# EAGLE design ASD2004 (EAGLE 6.3)
DATABASE: ./../../../../../Components/TinyCircuits_Part_Database.txt
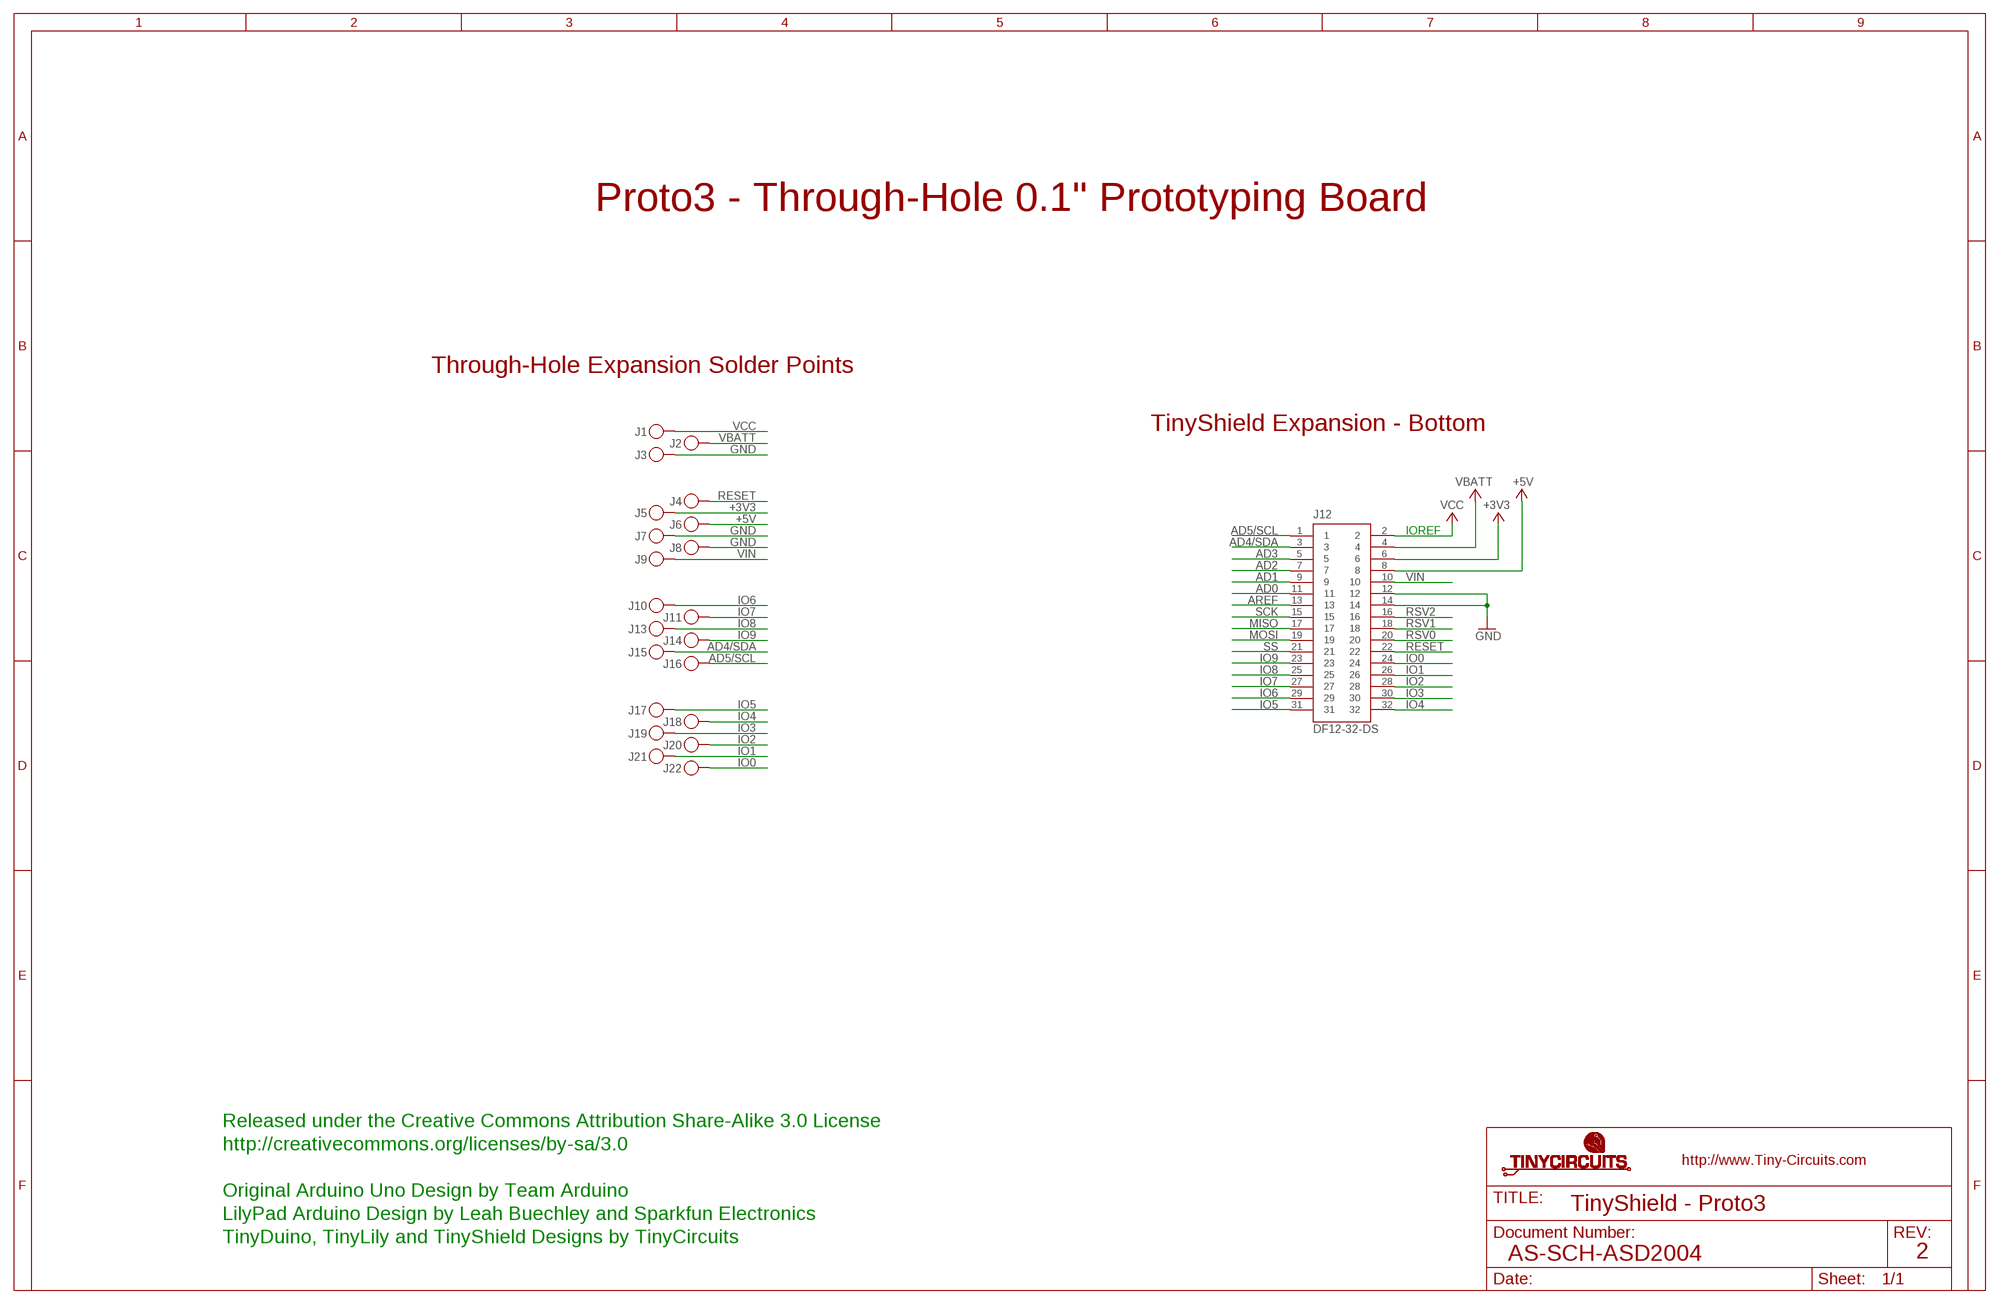
[diagram p0: schematic, sheet 1]

## Parts
J1  PIN_1X.1"1  [1X.1"_2]
J2  PIN_1X.1"1  [1X.1"_2]
J3  PIN_1X.1"1  [1X.1"_2]
J4  PIN_1X.1"1  [1X.1"_2]
J5  PIN_1X.1"1  [1X.1"_2]
J6  PIN_1X.1"1  [1X.1"_2]
J7  PIN_1X.1"1  [1X.1"_2]
J8  PIN_1X.1"1  [1X.1"_2]
J9  PIN_1X.1"1  [1X.1"_2]
J10  PIN_1X.1"1  [1X.1"_2]
J11  PIN_1X.1"1  [1X.1"_2]
J12  DF12-32-DS  AS-ITM-00012  [DF12-32-DS]
J13  PIN_1X.1"1  [1X.1"_2]
J14  PIN_1X.1"1  [1X.1"_2]
J15  PIN_1X.1"1  [1X.1"_2]
J16  PIN_1X.1"1  [1X.1"_2]
J17  PIN_1X.1"1  [1X.1"_2]
J18  PIN_1X.1"1  [1X.1"_2]
J19  PIN_1X.1"1  [1X.1"_2]
J20  PIN_1X.1"1  [1X.1"_2]
J21  PIN_1X.1"1  [1X.1"_2]
J22  PIN_1X.1"1  [1X.1"_2]

## Nets
+3V3: J5.1 J12.6
+5V: J6.1 J12.8
AD0: J12.11
AD1: J12.9
AD2: J12.7
AD3: J12.5
AD4/SDA: J12.3 J15.1
AD5/SCL: J12.1 J16.1
AREF: J12.13
GND: J3.1 J7.1 J8.1 J12.12 J12.14
IO0: J12.24 J22.1
IO1: J12.26 J21.1
IO2: J12.28 J20.1
IO3: J12.30 J19.1
IO4: J12.32 J18.1
IO5: J12.31 J17.1
IO6: J10.1 J12.29
IO7: J11.1 J12.27
IO8: J12.25 J13.1
IO9: J12.23 J14.1
MISO: J12.17
MOSI: J12.19
RESET: J4.1 J12.22
RSV0: J12.20
RSV1: J12.18
RSV2: J12.16
SCK: J12.15
SS: J12.21
VBATT: J2.1 J12.4
VCC: J1.1 J12.2
VIN: J9.1 J12.10

## Notes on the sheet
- Proto3 - Through-Hole 0.1" Prototyping Board
- Through-Hole Expansion Solder Points
- TinyShield Expansion - Bottom
- IOREF
- Released under the Creative Commons Attribution Share-Alike 3.0 License
- http://creativecommons.org/licenses/by-sa/3.0
- Original Arduino Uno Design by Team Arduino
- TinyShield - Proto3
- LilyPad Arduino Design by Leah Buechley and Sparkfun Electronics
- TinyDuino, TinyLily and TinyShield Designs by TinyCircuits
- AS-SCH-ASD2004 | 2

## Library data of the parts
J1-J11 J13-J22 = tinycircuits:PIN_1X.1": 1 Pin 0.100" Header; BOM: EXCLUDE; DNP: T; PARTNO: COPPER
J12 = tinycircuits:AS-ITM-00012: CONN RECEPT 32POS 3MM SMD 0.5MM; PARTNO: AS-ITM-00012

## Board
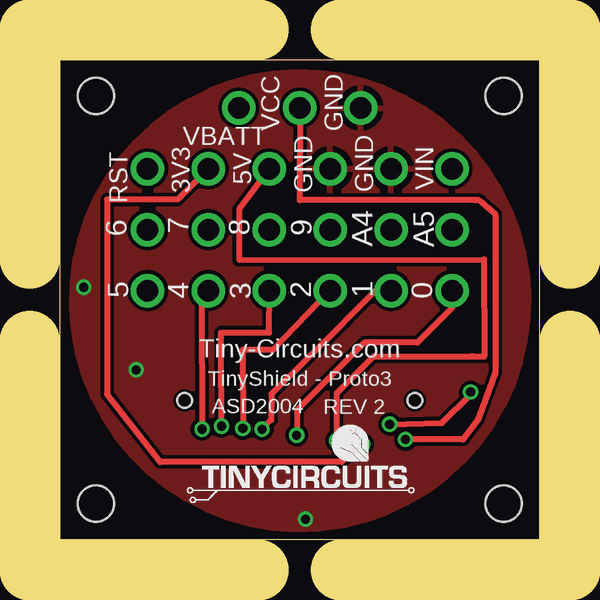
[diagram p1: board, top side]
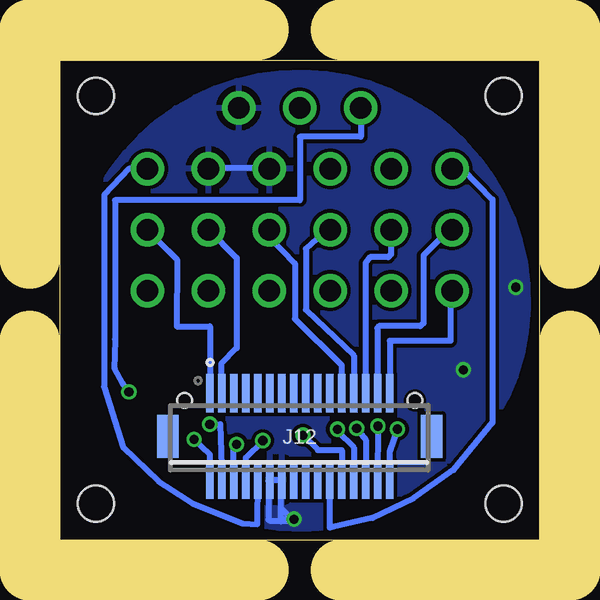
[diagram p2: board, bottom side, seen from below]

Size 20 x 20 mm. Coordinates in mm from the lower left corner, seen from the top.
Outline: 0,0 0,20 20,20 20,0 0,0
Copper layers (1*16): Top 0.035mm / dielectric 1.5mm / Bottom 0.035mm
Design rules "default *": minimum track width 8mil, minimum drill 15mil, track to track 6mil, track to pad 6mil, pad to pad 6mil, via to via 6mil, smd to smd 6mil, copper to edge 6mil, drill to drill 8mil, minimum pad ring 10mil, minimum via ring 5mil, stop-mask expansion 4mil, vias tented up to drill 25mil, thermal gap 10mil
Holes 1.5 mm at 1.5,18.5 18.5,18.5 18.5,1.5 1.5,1.5
Milling: 8 lines

### Footprints (pad centres in the part's own frame; a part is rotated, then mirrored left to right if it is on the bottom)
1X.1"_2 = drill 0.889 pad 1.397: 1 0,0
DF12-32-DS = smd 0.3 x 1.6: 1 -3.75,1.8; 2 -3.75,-1.8; 3 -3.25,1.8; 4 -3.25,-1.8; 5 -2.75,1.8; 6 -2.75,-1.8; 7 -2.25,1.8; 8 -2.25,-1.8; 9 -1.75,1.8; 10 -1.75,-1.8; 11 -1.25,1.8; 12 -1.25,-1.8; 13 -0.75,1.8; 14 -0.75,-1.8; 15 -0.25,1.8; 16 -0.25,-1.8; 17 0.25,1.8; 18 0.25,-1.8; 19 0.75,1.8; 20 0.75,-1.8; 21 1.25,1.8; 22 1.25,-1.8; 23 1.75,1.8; 24 1.75,-1.8; 25 2.25,1.8; 26 2.25,-1.8; 27 2.75,1.8; 28 2.75,-1.8; 29 3.25,1.8; 30 3.25,-1.8; 31 3.75,1.8; 32 3.75,-1.8 | smd 0.9 x 1.8: F1 -5.5,0; F2 5.5,0 | hole 0.6: -4.8,1.5; 4.8,1.5

### Placement (x,y rotation side)
J1  10,18 0 top
J2  7.46,18 0 top
J3  12.54,18 0 top
J4  3.65,15.46 0 top
J5  6.19,15.46 0 top
J6  8.73,15.46 0 top
J7  11.27,15.46 0 top
J8  13.81,15.46 0 top
J9  16.35,15.46 0 top
J10  3.65,12.92 0 top
J11  6.19,12.92 0 top
J12  10,4.3 0 bottom
J13  8.73,12.92 0 top
J14  11.27,12.92 0 top
J15  13.81,12.92 0 top
J16  16.35,12.92 0 top
J17  3.65,10.38 0 top
J18  6.19,10.38 0 top
J19  8.73,10.38 0 top
J20  11.27,10.38 0 top
J21  13.81,10.38 0 top
J22  16.35,10.38 0 top
U$1  [DOCFIELD-TINYCIRCUITS-PCB]  33.91,-10 0 top  (outside the outline)

### Tracks (layer width: path | path; a pad name or v marks a point on that pad's centre or on a via)
+3V3  (via drill 0.38)
  Top 0.254: J5.1 4.91,14.18 1.96,14.18 1.96,6.05 4.17,3.23 11.74,3.23 v12.63,3.97
  Bottom 0.254: J12.6 12.76,3.79 v12.63,3.97
+5V  (via drill 0.38)
  Top 0.254: J6.1 7.48,13.77 7.48,11.67 17.68,11.68 17.7,7.63 17.13,7.63 17.11,7.63 | v11.54,4.12 11.54,6.1 13.09,7.65 13.16,7.65 13.18,7.63 17.11,7.63 | 17.25,7.63 17.11,7.63
  Bottom 0.254: v11.54,4.12 12.25,3.41 J12.8
AD4/SDA
  Bottom 0.254: J15.1 12.63,11.75 12.63,7.98 13.28,7.33 13.28,6.13 J12.3
AD5/SCL
  Bottom 0.254: J16.1 15.48,12.05 15.31,11.87 15.12,11.68 15.13,8.89 13.75,8.89 J12.1
GND  (via drill 0.38)
  Bottom 0.254: v10.24,0.85 10.69,0.85 10.8,0.74 10.8,2.45 J12.14 J12.12 11.31,2.44 11.31,0.83 11.27,0.79 10.29,0.79 10.29,0.81 10.78,1.3 10.78,2.6 | J7.1 11.25,15.44 11.24,15.44 | 11.24,15.44 11.23,15.43 | 11.24,15.44 J7.1 11.26,15.48 | 11.26,15.49 11.26,15.48 | 11.26,15.48 11.27,15.49 13.81,15.49 13.87,15.43 13.87,15.4
  other vias: 0.99,10.52 3.18,7.08
  pour Top: 18.49,5.61 arc180 1.54,14.32 arc180
  pour Bottom: 18.49,5.61 arc180 1.54,14.32 arc180
IO0  (via drill 0.38)
  Top 0.254: J22.1 16.35,9.66 14.9,8.21 12.69,8.21 9.88,5.4 v9.88,4.36 v9.87,4.35
  Bottom 0.254: v9.87,4.35 9.25,3.73 8.28,3.73 8.25,3.72 J12.24
IO1  (via drill 0.38)
  Top 0.254: J21.1 13.15,10.38 11.99,9.22 11.82,9.03 8.82,6.07 8.81,4.98 v8.43,4.6
  Bottom 0.254: v8.43,4.6 8.43,4.52 7.75,3.84 J12.26
IO2  (via drill 0.38)
  Top 0.254: J20.1 8.89,7.91 7.62,7.91 v7.63,4.63
  Bottom 0.254: J12.28 7.25,2.48 7.25,4.15 v7.63,4.63
IO3  (via drill 0.38)
  Top 0.254: v6.74,4.73 6.74,4.76 6.72,7.86 6.72,8.63 8.73,8.63 J19.1
  Bottom 0.254: v6.74,4.73 6.76,2.54 J12.30
IO4  (via drill 0.38)
  Top 0.254: J18.1 5.92,9.99 v5.93,4.61
  Bottom 0.254: v5.93,4.61 6.25,3.66 J12.32
IO5
  Bottom 0.254: J17.1 3.71,10.38 3.71,8.29 6.25,8.29 J12.31
IO6
  Bottom 0.254: J10.1 3.77,12.92 4.84,11.85 4.84,9.03 4.97,8.9 6.69,8.9 6.77,8.82 6.77,6.12 J12.29
IO7
  Bottom 0.254: J11.1 6.19,11.9 6.31,11.78 7.07,11.78 7.26,11.54 7.26,6.22 J12.27
IO8
  Bottom 0.254: J13.1 8.87,12.92 9.74,12.13 9.74,9.58 7.75,7.67 J12.25
IO9
  Bottom 0.254: J14.1 11.27,12.61 10.2,11.52 10.2,9.2 8.26,7.28 J12.23
RESET
  Bottom 0.254: J4.1 3.22,15.46 1.96,14.18 1.96,4.88 3.59,2.9 5.27,1.71 6.97,0.9 8.59,0.54 8.75,0.49 J12.22
VBATT  (via drill 0.38)
  Top 0.254: v13.75,4.81 15.93,4.86 17.15,6.08 17.2,6.26 v17.13,6.15
  Bottom 0.254: J2.1 7.45,16.8 9.99,16.8 9.99,14.16 17.7,14.16 17.7,8.36 17.69,8.33 17.71,7.12 17.38,6.51 v17.13,6.15 | v13.75,4.81 13.32,4.81 J12.4
VCC  (via drill 0.38)
  Top 0.254: J1.1 9.99,14.16 17.34,14.16 17.44,14.16 17.6,14.06 17.89,13.81 18.15,13.57 18.15,6.96 17.43,4.98 16.82,4.2 16.82,4.17 v14.41,4.17
  Bottom 0.254: J12.2 13.75,3.55 v14.41,4.17
VIN
  Bottom 0.254: J9.1 17.12,15.46 18.15,14.37 18.16,6.37 17.36,3.84 15.88,2.42 14.43,1.48 12.38,0.67 11.77,0.64 J12.10

### Text on the board
tPlace: VBATT | VCC | GND | 5V | VIN | RST | 3V3 | GND | GND | 6 | 7 | 8 | 9 | A4 | A5 | 5 | 4 | 3 | 2 | 1 | 0 | Tiny-Circuits.com | TinyShield - Proto3 | ASD2004 | REV 2
Document: FABRICATION DRAWING | NOTES: | 1. PRINTED CIRCUIT BOARD MADE FROM NEMA GRADE FR-4 EPOXY LAMINATE | WITH 1 OUNCE COPPER PLATING AND .024 THICKNESS. | 2. ALL DIMENSIONS ARE GIVEN IN INCHES. | 3. CIRCUIT PATHS ARE FOR REFERENCE ONLY. | 4. HOLE SIZES SHOWN ARE FINISHED DIAMETERS AFTER PLATING. | 5. BOARD PLATED USING REFLOW OR SIMILAR METHOD. | 6. BOARD TO HAVE BLUE SOLDER MASK ON PLATED SURFACES USING WET FILM | 7. SILKSCREEN BOARD USING WHITE INK. | SR100 OR SR1010 EPOXY. EQUIVALENT WET OR DRY FILM MAY BE USED. | 8. THE FOLLOWING INFORMATION APPLIES TO THIS BOARD: | * 2 COPPER LAYERS | * .024 BOARD THICKNESS | * REQUIRES TOP SIDE SILKSCREEN | Released under the Creative Commons Attribution Share-Alike 3.0 License | http://creativecommons.org/licenses/by-sa/3.0 | Original Arduino Uno Design by Team Arduino | LilyPad Arduino Design by Leah Buechley and Sparkfun Electronics | TinyDuino, TinyLily and TinyShield Designs by TinyCircuits | TinyShield - Proto3 | AS-PCB-ASD2004 | 2 | 1/1